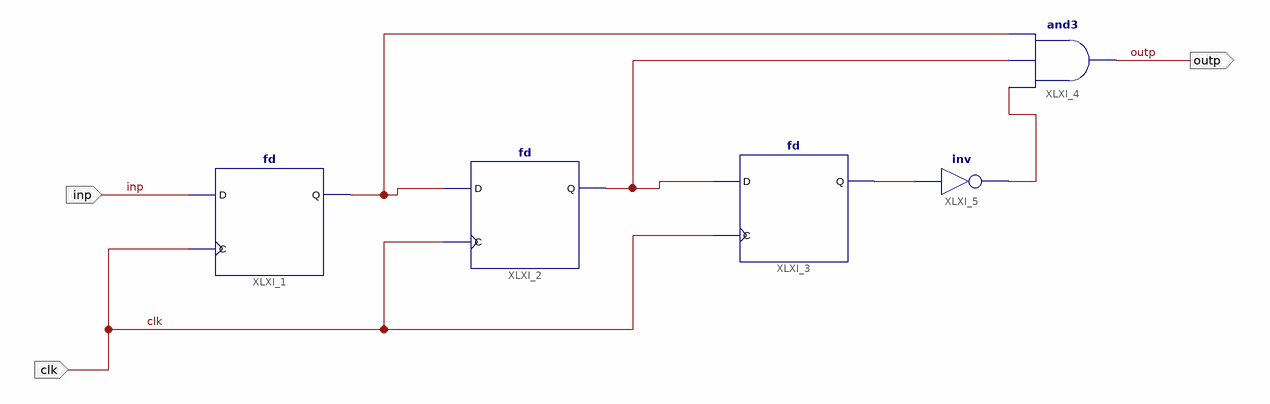
[diagram p0: schematic sheet 1]
// Xilinx ISE schematic pulse.sch (spartan6) as structural Verilog: 5 symbols, 3 ports
module pulse (
  input  clk,
  input  inp,
  output outp
);

  wire XLXN_4, XLXN_5, XLXN_6, XLXN_7;

  fd XLXI_1 (.C(clk), .D(inp), .Q(XLXN_4));
  fd XLXI_2 (.C(clk), .D(XLXN_4), .Q(XLXN_5));
  fd XLXI_3 (.C(clk), .D(XLXN_5), .Q(XLXN_6));
  and XLXI_4 (outp, XLXN_7, XLXN_5, XLXN_4);
  not XLXI_5 (XLXN_7, XLXN_6);
endmodule
